# EAGLE design scr_gate (EAGLE 7.6.0)
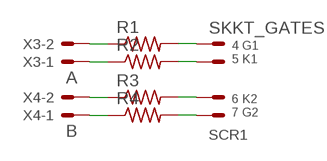
[diagram p0: schematic, sheet 1]

## Parts
R1  R-US_M0805  [M0805]
R2  R-US_M0805  [M0805]
R3  R-US_M0805  [M0805]
R4  R-US_M0805  [M0805]
SCR1  SKKT_GATES  [SKKT_GATES]
X3  A  22-23-2021  [22-23-2021]
X4  B  22-23-2021  [22-23-2021]

## Nets
N$1: R3.2 SCR1.P$3 SCR1.P$7
N$2: R1.2 SCR1.P$1 SCR1.P$5
N$3: R2.2 SCR1.P$2 SCR1.P$6
N$4: R2.1 X3.1
N$5: R4.2 SCR1.P$4 SCR1.P$8
N$6: R1.1 X3.2
N$7: R4.1 X4.1
N$8: R3.1 X4.2

## Library data of the parts
R1-R4 = resistor:R-US_: RESISTOR, American symbol
SCR1 = Alex:SKKT_GATES: Semikron SKKT Dual SCR Module Gates
X3 X4 = con-molex:22-23-2021: .100" (2.54mm) Center Header - 2 Pin; MF: MOLEX; MPN: 22-23-2021; OC_FARNELL: 1462926; OC_NEWARK: 25C3832

## Board
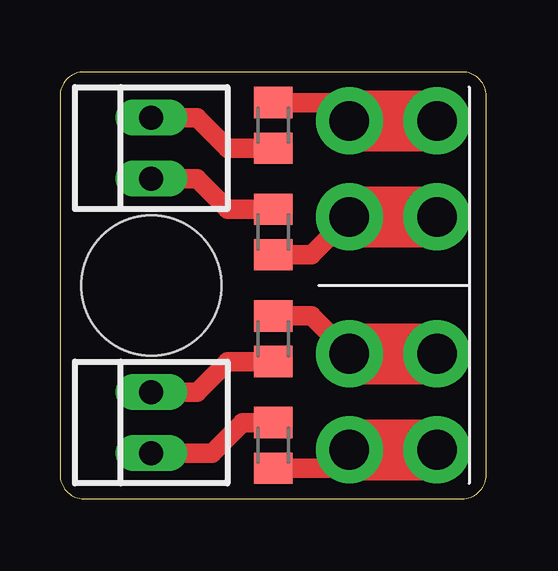
[diagram p1: board, top side]

Size 17.78 x 17.78 mm. Coordinates in mm from the lower left corner, seen from the top.
Outline: 0,16.78 0,1 arc90 1,0 16.78,0 arc90 17.78,1 17.78,16.78 arc90 16.78,17.78 1,17.78 arc90 0,16.78
Copper layers (1*16): Top 0.035mm / dielectric 1.5mm / Bottom 0.035mm
Design rules "default": minimum track width 10mil, minimum drill 24mil, track to track 8mil, track to pad 8mil, pad to pad 8mil, via to via 8mil, smd to smd 8mil, copper to edge 40mil, drill to drill 8mil, minimum pad ring 10mil, minimum via ring 8mil, stop-mask expansion 4mil, vias tented up to drill 0mil, thermal gap 10mil
Holes 5.84 mm at 3.81,8.89

### Footprints (pad centres in the part's own frame; a part is rotated, then mirrored left to right if it is on the bottom)
M0805 = smd 1.3 x 1.6: 1 -0.95,0; 2 0.95,0
SKKT_GATES = drill 1.651 pad 2.794: P$1 0,6.85; P$2 0,2.85; P$3 0,-2.85; P$4 0,-6.85; P$5 3.658,6.85; P$6 3.658,2.85; P$7 3.658,-2.85; P$8 3.658,-6.85
22-23-2021 = drill 1 long: 1 -1.27,0; 2 1.27,0

### Placement (x,y rotation side)
R1  8.89,15.56 90 top
R2  8.89,11.11 270 top
R3  8.89,6.67 90 top
R4  8.89,2.22 270 top
SCR1  12.06,8.89 0 top
X3  3.81,14.61 90 top
X4  3.81,3.17 90 top

### Tracks (layer width: path | path; a pad name or v marks a point on that pad's centre or on a via)
N$1
  Top 0.813: R3.2 10.49,7.62 SCR1.P$3
  Top 2.54: SCR1.P$3 SCR1.P$7
N$2
  Top 0.813: R1.2 11.3,16.51 SCR1.P$1
  Top 2.54: SCR1.P$1 SCR1.P$5
N$3
  Top 0.813: R2.2 10.49,10.16 SCR1.P$2
  Top 2.54: SCR1.P$2 SCR1.P$6
N$4
  Top 0.813: X3.1 5.71,13.34 6.99,12.06 R2.1
N$5
  Top 0.813: R4.2 11.3,1.27 SCR1.P$4
  Top 2.54: SCR1.P$4 SCR1.P$8
N$6
  Top 0.813: X3.2 5.71,15.88 6.98,14.61 R1.1
N$7
  Top 0.813: X4.1 6.35,1.91 7.62,3.17 R4.1
N$8
  Top 0.813: X4.2 5.71,4.45 6.99,5.72 R3.1

### Text on the board
bNames: SKKT SCR Gate Board / Alex Yuan / Feb 2021